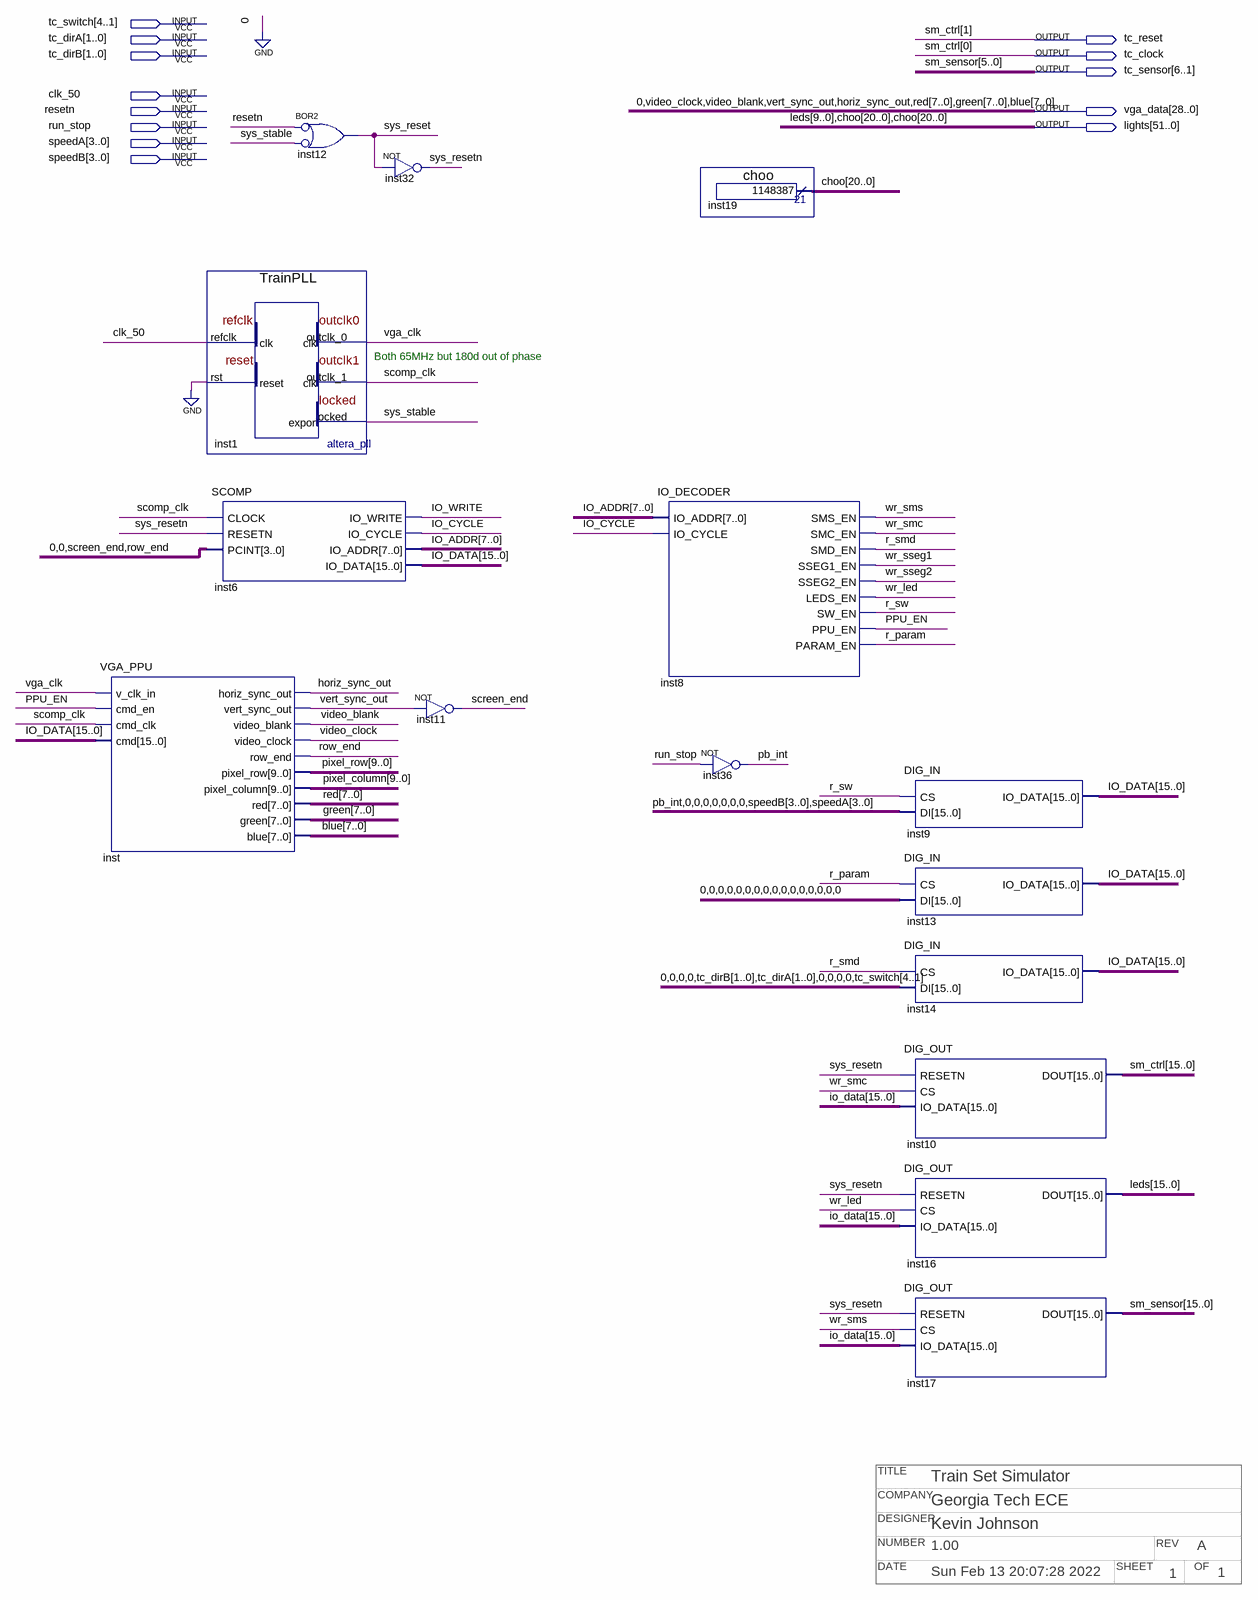
[diagram p0: schematic sheet]
// Quartus schematic TrainSetSimulator.bdf as structural Verilog: 15 symbols, 13 pins
// Title block: COMPANY: Georgia Tech ECE; DATE: Sun Feb 13 20:07:28 2022; DESIGNER: Kevin Johnson; NUMBER: 1.00; OF: 1; REV: A; SHEET: 1; TITLE: Train Set Simulator
module TrainSetSimulator (
  input  [4:1] tc_switch,
  input  [1:0] tc_dirA,
  input  [1:0] tc_dirB,
  input  clk_50,
  input  resetn,
  input  run_stop,
  input  [3:0] speedA,
  input  [3:0] speedB,
  output tc_reset,
  output tc_clock,
  output [6:1] tc_sensor,
  output [28:0] vga_data,
  output [51:0] lights
);

  wire IO_CYCLE, IO_WRITE, pb_int, PPU_EN, r_param, r_smd, r_sw, row_end, scomp_clk, screen_end, sys_reset,
       sys_resetn, sys_stable, vga_clk, wr_led, wr_smc, wr_sms, wr_sseg1, wr_sseg2;
  wire [7:0] IO_ADDR;
  wire [9:0] pixel_column, pixel_row;
  wire [15:0] IO_DATA;
  wire [15:2] sm_ctrl;
  wire [15:6] sm_sensor;
  wire [15:10] leds;

  VGA_PPU inst (
    .v_clk_in(vga_clk), .cmd_en(PPU_EN), .cmd_clk(scomp_clk), .cmd(IO_DATA), .horiz_sync_out(vga_data[24]),
    .vert_sync_out(vga_data[25]), .video_blank(vga_data[26]), .video_clock(vga_data[27]), .row_end(row_end),
    .pixel_row(pixel_row), .pixel_column(pixel_column), .red(vga_data[23:16]), .green(vga_data[15:8]),
    .blue(vga_data[7:0]));
  TrainPLL inst1 (.refclk(clk_50), .rst(1'b0), .outclk_0(vga_clk), .outclk_1(scomp_clk), .locked(sys_stable));
  SCOMP inst6 (
    .CLOCK(scomp_clk), .RESETN(sys_resetn), .PCINT({2'b00, screen_end, row_end}), .IO_WRITE(IO_WRITE),
    .IO_CYCLE(IO_CYCLE), .IO_ADDR(IO_ADDR), .IO_DATA(IO_DATA));
  or inst12 (sys_reset, ~resetn, ~sys_stable);  // BOR2
  not inst32 (sys_resetn, sys_reset);
  not inst11 (screen_end, vga_data[25]);
  IO_DECODER inst8 (
    .IO_ADDR(IO_ADDR), .IO_CYCLE(IO_CYCLE), .SMS_EN(wr_sms), .SMC_EN(wr_smc), .SMD_EN(r_smd),
    .SSEG1_EN(wr_sseg1), .SSEG2_EN(wr_sseg2), .LEDS_EN(wr_led), .SW_EN(r_sw), .PPU_EN(PPU_EN),
    .PARAM_EN(r_param));
  choo inst19 (.result(lights[41:21]));
  not inst36 (pb_int, run_stop);
  DIG_IN inst9 (.CS(r_sw), .DI({pb_int, {7{1'b0}}, speedB, speedA}), .IO_DATA(IO_DATA));
  DIG_IN inst13 (.CS(r_param), .DI({16{1'b0}}), .IO_DATA(IO_DATA));
  DIG_IN inst14 (.CS(r_smd), .DI({4'b0000, tc_dirB, tc_dirA, 4'b0000, tc_switch}), .IO_DATA(IO_DATA));
  DIG_OUT inst10 (.RESETN(sys_resetn), .CS(wr_smc), .IO_DATA(IO_DATA), .DOUT({sm_ctrl, tc_reset, tc_clock}));
  DIG_OUT inst16 (.RESETN(sys_resetn), .CS(wr_led), .IO_DATA(IO_DATA), .DOUT({leds, lights[51:42]}));
  DIG_OUT inst17 (.RESETN(sys_resetn), .CS(wr_sms), .IO_DATA(IO_DATA), .DOUT({sm_sensor, tc_sensor}));

  assign lights[20:0] = lights[41:21];
  assign vga_data[28] = 1'b0;

  // Other names for the same wires on the sheet: blue[7:0] = vga_data[7:0]; choo[20:0] = lights[41:21];
  //   green[7:0] = vga_data[15:8]; horiz_sync_out = vga_data[24]; leds[9:0] = lights[51:42];
  //   red[7:0] = vga_data[23:16]; sm_ctrl[1:0] = {tc_reset, tc_clock}; sm_sensor[5:0] = tc_sensor;
  //   vert_sync_out = vga_data[25]; video_blank = vga_data[26]; video_clock = vga_data[27]

  // Notes on the sheet:
  //   Both 65MHz but 180d out of phase
endmodule
